# EAGLE design connecter (EAGLE 5.07)
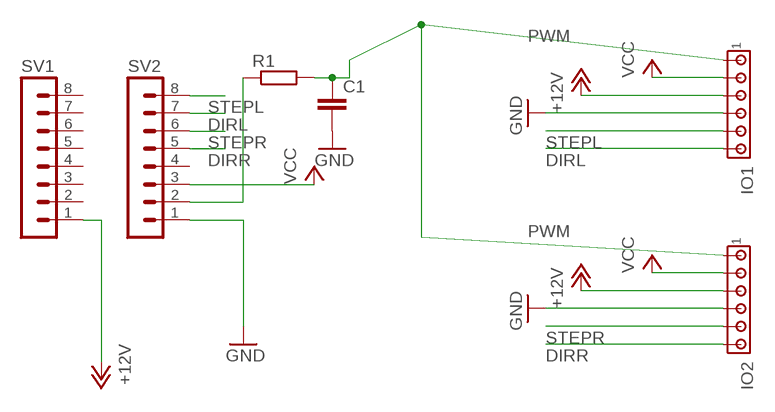
[diagram p0: schematic, sheet 1]

## Parts
C1  C-EU050-025X075  [C050-025X075]
IO1  MTA06-100  [10X06MTA]
IO2  MTA06-100  [10X06MTA]
R1  R-EU_0204/7  [0204/7]
SV1  MA08-1  [MA08-1]
SV2  MA08-1  [MA08-1]

## Nets
+12V [power]: IO1.4 IO2.4 SV1.1
DIRL: IO1.1 SV2.7
DIRR: IO2.1 SV2.5
GND: C1.2 IO1.3 IO2.3 SV2.1
N$1: R1.1 SV2.2
PWM: C1.1 IO1.6 IO2.6 R1.2
STEPL: IO1.2 SV2.8
STEPR: IO2.2 SV2.6
VCC: IO1.5 IO2.5 SV2.3
Unconnected: SV1.2 SV1.3 SV1.4 SV1.5 SV1.6 SV1.7 SV1.8 SV2.4

## Library data of the parts
C1 = matt rcl:C-EU: CAPACITOR, European symbol
IO1 IO2 = matt con-amp:MTA06-100: AMP connector
R1 = matt rcl:R-EU_: RESISTOR, European symbol
SV1 SV2 = con-lstb:MA08-1: PIN HEADER

## Net classes
1 power: width 2 mm

## Board
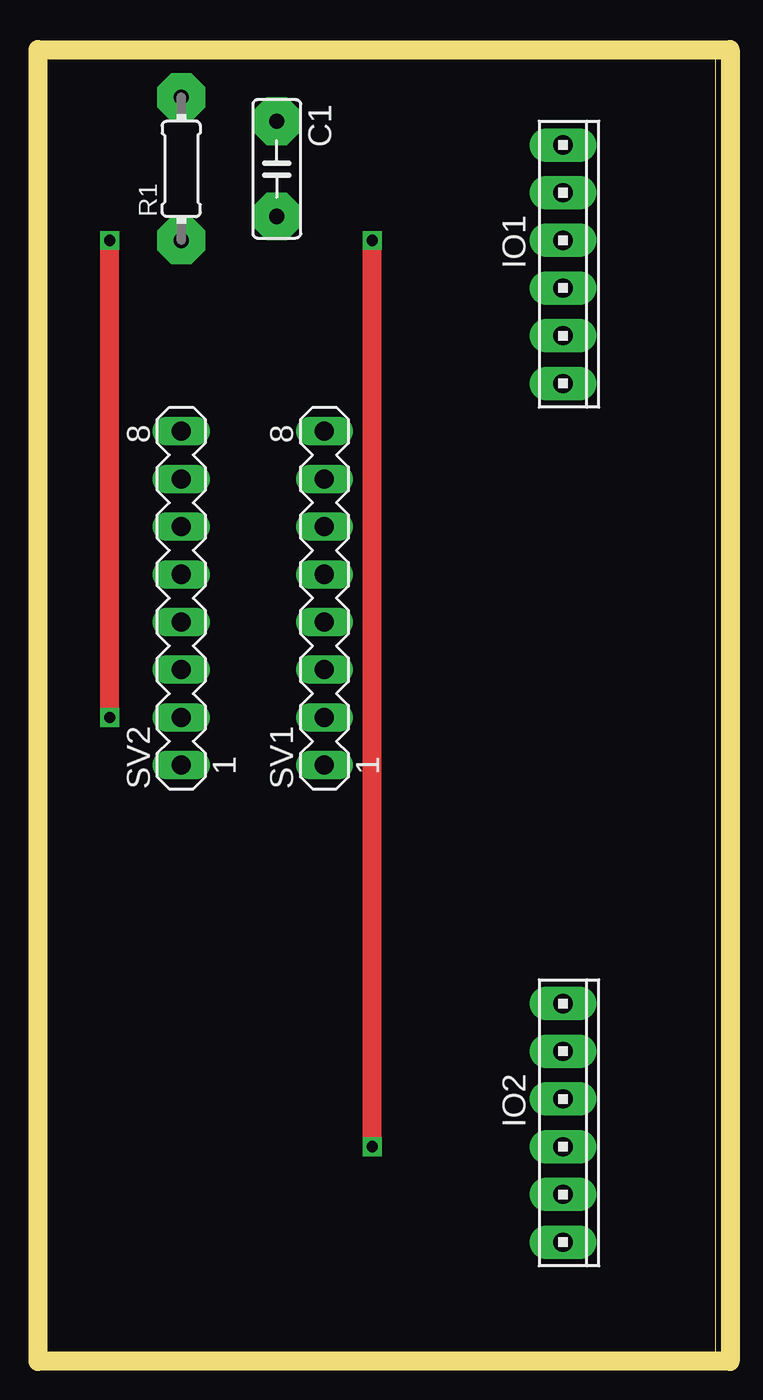
[diagram p1: board, top side]
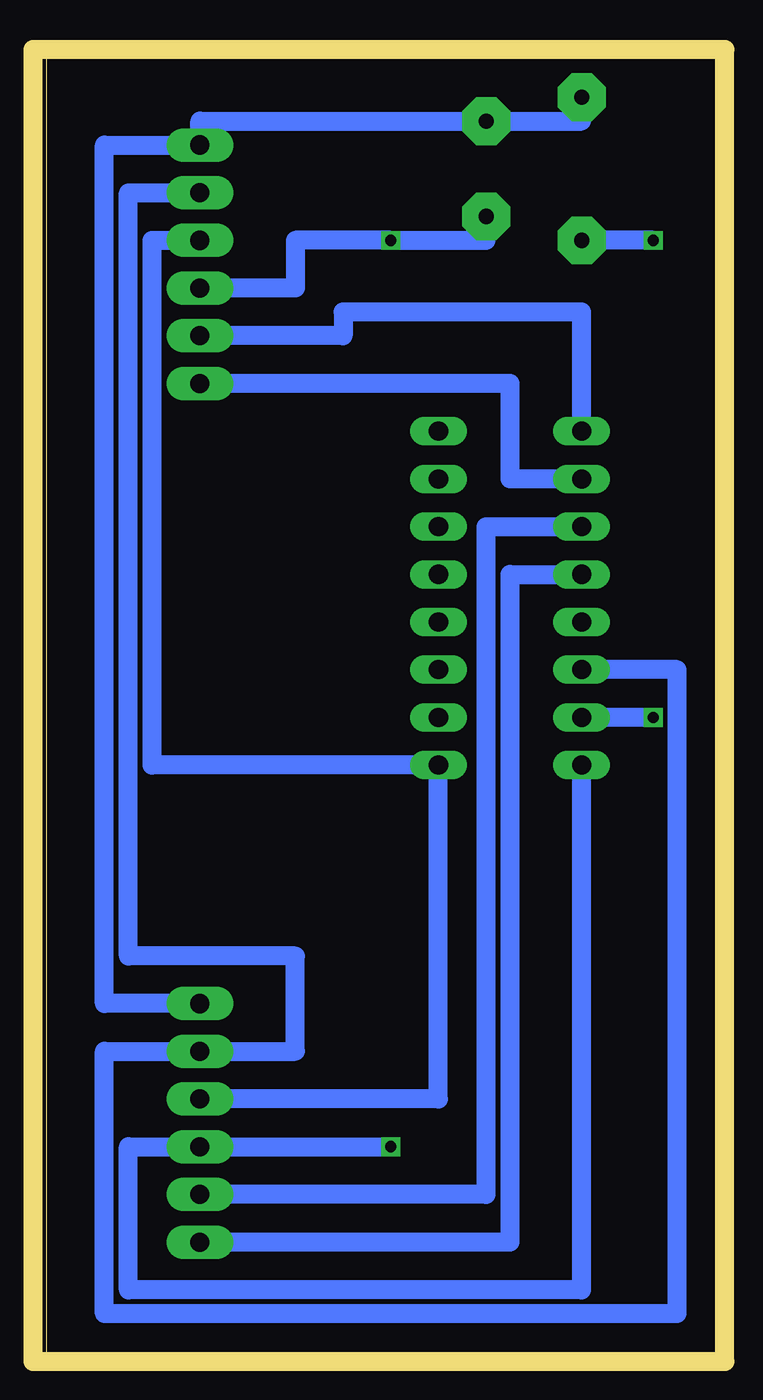
[diagram p2: board, bottom side, seen from below]

Size 35.61 x 69.52 mm. Coordinates in mm from the lower left corner, seen from the top.
Outline: 0,0 35.61,0 35.61,69.52 0,69.52 0,0
Copper layers (1*16): Top 0.035mm / dielectric 1.5mm / Bottom 0.035mm
Design rules "default": minimum track width 10mil, minimum drill 24mil, track to track 8mil, track to pad 8mil, pad to pad 8mil, via to via 8mil, smd to smd 8mil, copper to edge 40mil, drill to drill 8mil, minimum pad ring 10mil, minimum via ring 8mil, stop-mask expansion 4mil, vias tented up to drill 0mil, thermal gap 10mil
Milling: 4 lines

### Footprints (pad centres in the part's own frame; a part is rotated, then mirrored left to right if it is on the bottom)
C050-025X075 = drill 0.813 pad 2.54 octagon: 1 -2.54,0; 2 2.54,0
10X06MTA = drill 1.016 pad 1.778 long: 1 6.35,0; 2 3.81,0; 3 1.27,0; 4 -1.27,0; 5 -3.81,0; 6 -6.35,0
0204/7 = drill 0.813 pad 2.54 octagon: 1 -3.81,0; 2 3.81,0
MA08-1 = drill 1.016 long: 1 -8.89,0; 2 -6.35,0; 3 -3.81,0; 4 -1.27,0; 5 1.27,0; 6 3.81,0; 7 6.35,0; 8 8.89,0

### Placement (x,y rotation side)
C1  12.23,63.03 270 top
IO1  27.47,57.95 270 top
IO2  27.47,12.23 270 top
R1  7.15,63.03 90 top
SV1  14.77,40.17 90 top
SV2  7.15,40.17 90 top

### Tracks (layer width: path | path; a pad name or v marks a point on that pad's centre or on a via)
+12V
  Bottom 1.016: IO2.4 14.77,13.5 SV1.1 30.01,31.28 30.01,59.22 IO1.4
DIRL
  Bottom 1.016: SV2.7 10.96,46.52 10.96,51.6 IO1.1
DIRR
  Bottom 1.016: SV2.5 10.96,41.44 10.96,5.88 IO2.1
GND  (via drill 0.6)
  Top 1.016: v17.31,10.96 v17.31,59.22
  Bottom 1.016: SV2.1 7.15,3.34 31.28,3.34 31.28,10.96 IO2.3 v17.31,10.96 | IO1.3 22.39,56.68 22.39,59.22 v17.31,59.22 12.23,59.22 C1.2
N$1  (via drill 0.6)
  Top 1.016: v3.34,33.82 v3.34,59.22
  Bottom 1.016: v3.34,59.22 R1.1 | v3.34,33.82 SV2.2
PWM
  Bottom 1.016: R1.2 7.15,65.57 C1.1 27.47,65.57 IO1.6 32.55,64.3 32.55,18.58 IO2.6
STEPL
  Bottom 1.016: SV2.8 7.15,55.41 19.85,55.41 19.85,54.14 IO1.2
STEPR
  Bottom 1.016: SV2.6 12.23,43.98 12.23,8.42 IO2.2
VCC
  Bottom 1.016: SV2.3 2.07,36.36 2.07,2.07 32.55,2.07 32.55,16.04 IO2.5 22.39,16.04 22.39,21.12 31.28,21.12 31.28,61.76 IO1.5